# EAGLE board de0 (EAGLE 9.6.2), part 1 of 2
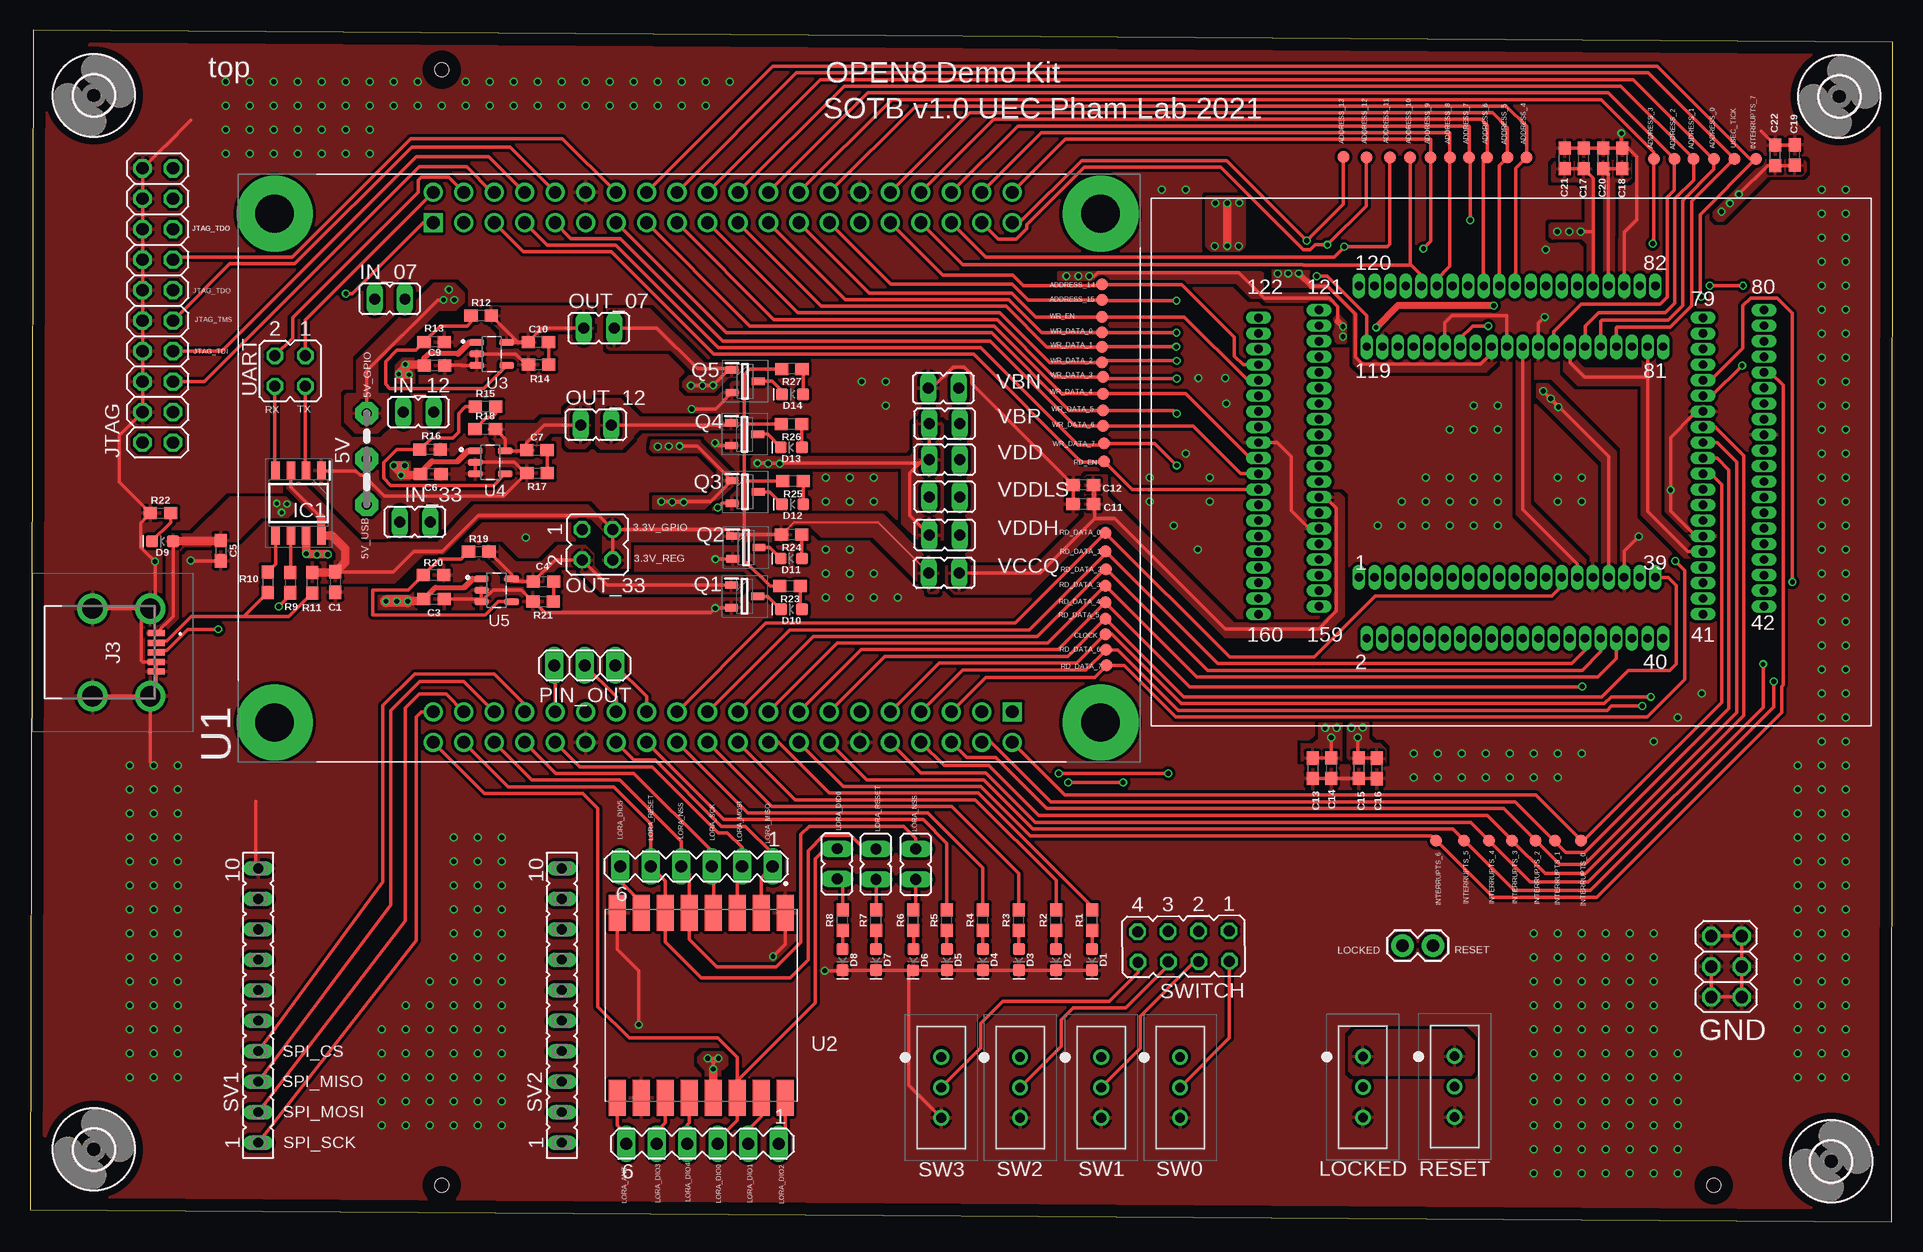
[diagram p2: board, top side]
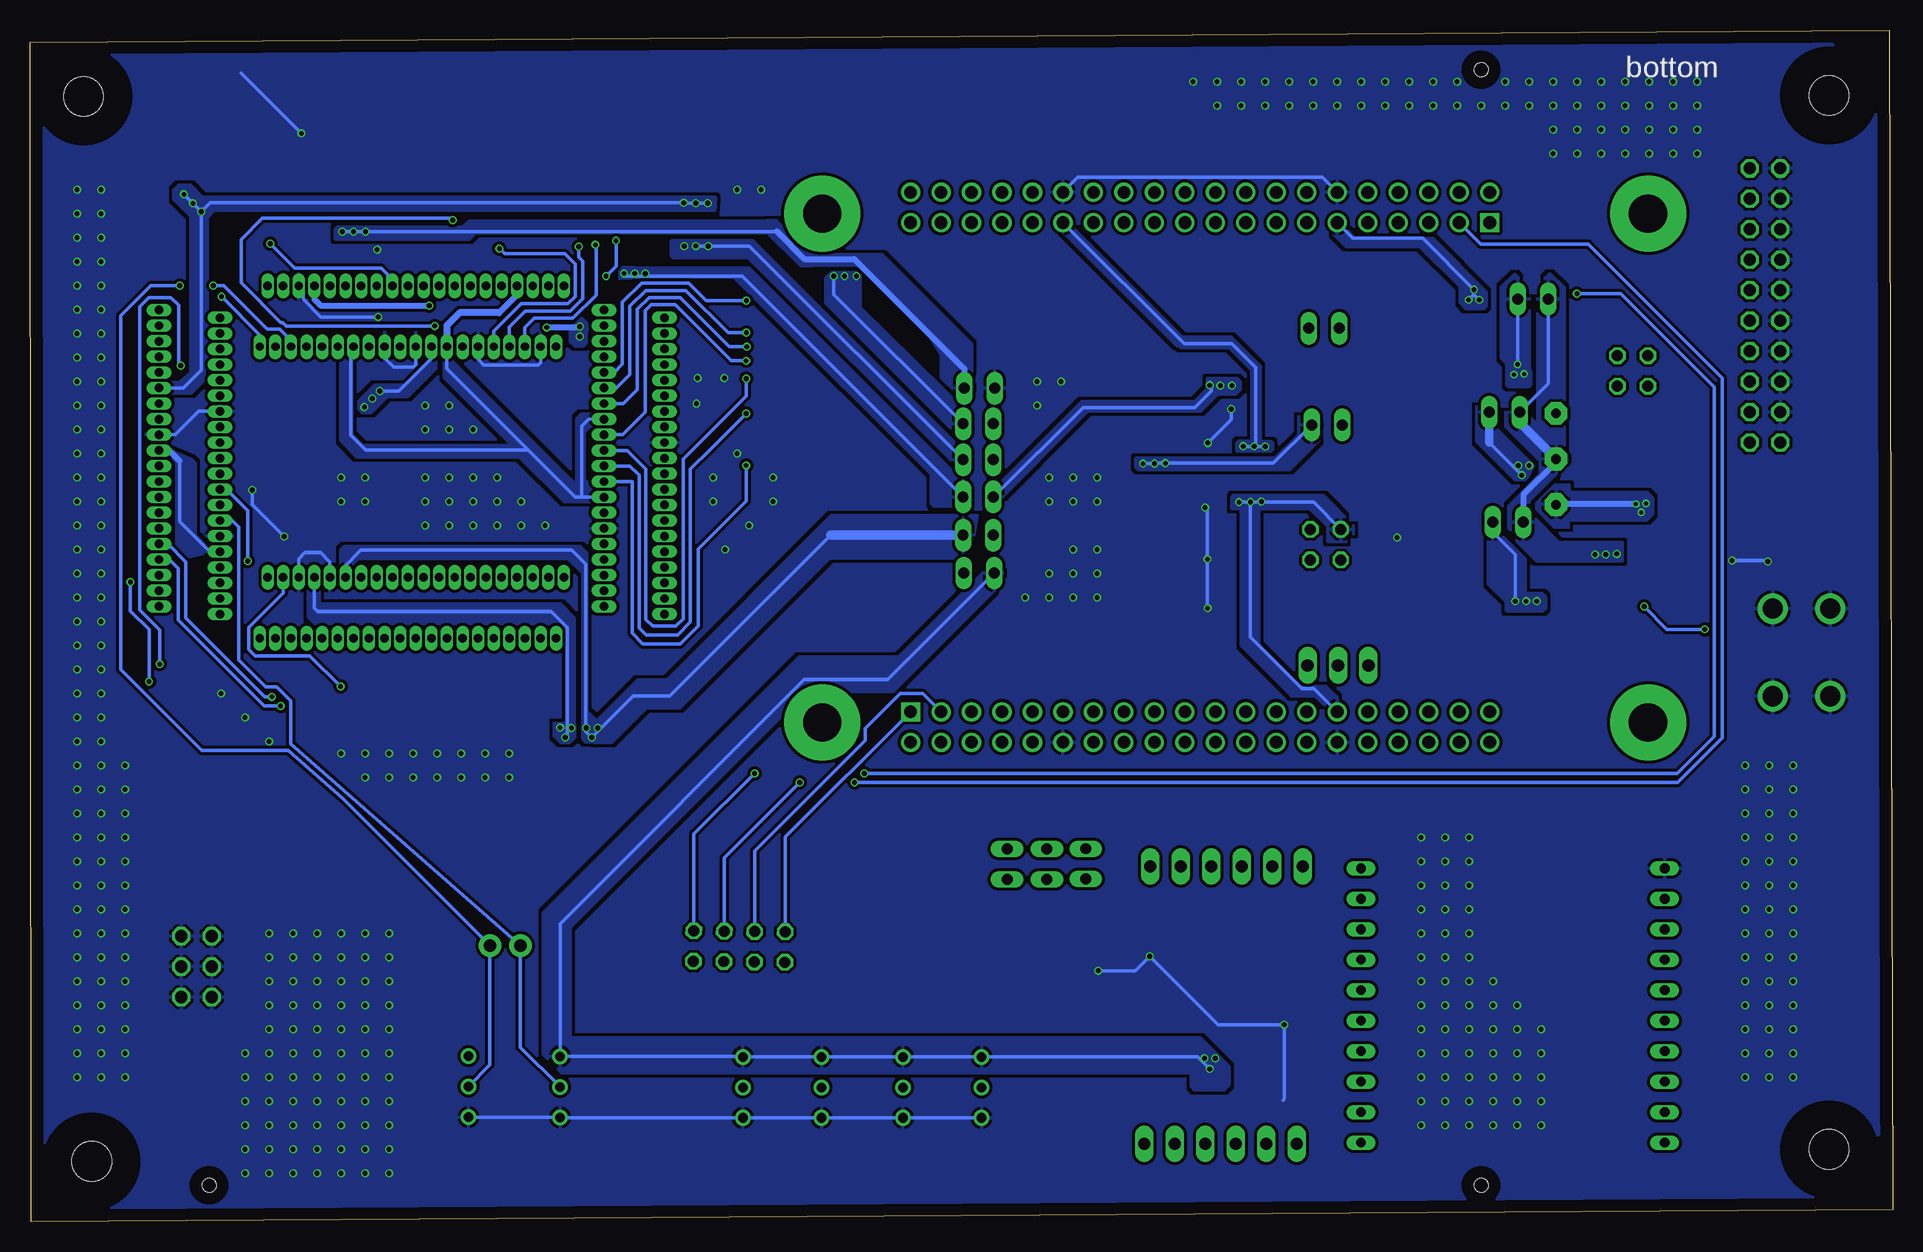
[diagram p3: board, bottom side, seen from below]

Size 155.24 x 99.34 mm. Coordinates in mm from the lower left corner, seen from the top.
Outline: 0,0.97 155.15,0 155.24,98.32 0.29,99.34 0,0.97
Copper layers (1*16): Top 0.035mm / dielectric 1.5mm / Bottom 0.035mm
Design rules "default *": minimum track width 6mil, minimum drill 0.35mm, track to track 10mil, track to pad 10mil, pad to pad 6mil, via to via 10mil, smd to smd 6mil, copper to edge 40mil, drill to drill 6mil, minimum pad ring 0.13mm, minimum via ring 0.13mm, stop-mask expansion 4mil, vias tented up to drill 0mil, thermal gap 10mil
Holes 1.15 mm at 34.32,96.02 140.32,3.02 34.32,3.02

## Footprints (pad centres in the part's own frame; a part is rotated, then mirrored left to right if it is on the bottom)
04C = drill 0.813 pad 1.905 octagon: 1 -1.905,0; 2 1.905,0; 3 5.715,0
POINT = smd 1 x 1: 1 0,0
0603 = smd 1.1 x 1: 1 -0.85,0; 2 0.85,0
LED-0603 = smd 1 x 1: A -0.877,0; C 0.877,0
3,3 = hole 3.3: 0,0
SOIC127P600X170-8N = smd 1.525 x 0.7: 1 -2.712,1.905; 2 -2.712,0.635; 3 -2.712,-0.635; 4 -2.712,-1.905; 5 2.712,-1.905; 6 2.712,-0.635; 7 2.712,0.635; 8 2.712,1.905
JP1 = drill 0.914 long: 1 0,-1.27; 2 0,1.27
1X02 = drill 1.016 pad 1.88: 1 0,0; 2 2.54,0
UMM5DDW1 = smd 0.5 x 1.4: 1 -1.6,3.625; 2 -0.8,3.625; 3 0,3.625; 4 0.8,3.625; 5 1.6,3.625 | drill 1.68 pad 2.5: MH1 -3.65,-1.675; MH2 3.65,-1.675; MH3 3.65,3.125; MH4 -3.65,3.125
2X03 = drill 1.016 octagon: 1 -2.54,-1.27; 2 -2.54,1.27; 3 0,-1.27; 4 0,1.27; 5 2.54,-1.27; 6 2.54,1.27
2X10 = drill 1.016 octagon: 1 -11.43,-1.27; 2 -11.43,1.27; 3 -8.89,-1.27; 4 -8.89,1.27; 5 -6.35,-1.27; 6 -6.35,1.27; 7 -3.81,-1.27; 8 -3.81,1.27; 9 -1.27,-1.27; 10 -1.27,1.27; 11 1.27,-1.27; 12 1.27,1.27; 13 3.81,-1.27; 14 3.81,1.27; 15 6.35,-1.27; 16 6.35,1.27; 17 8.89,-1.27; 18 8.89,1.27; 19 11.43,-1.27; 20 11.43,1.27
SS12SDP2 = drill 0.8 pad 1.3: 1 0,2.54; 2 0,0; 3 0,-2.54
JP2Q = drill 0.914 octagon: 1 -1.27,-1.27; 2 -1.27,1.27; 3 1.27,-1.27; 4 1.27,1.27
1X03 = drill 1.016 long: 1 -2.54,0; 2 0,0; 3 2.54,0
SOT95P230X110-3N = smd 1.05 x 0.6: 1 -1.1,0.95; 2 -1.1,-0.95; 3 1.1,0
FE10 = drill 0.813 long: 1 -11.43,0; 2 -8.89,0; 3 -6.35,0; 4 -3.81,0; 5 -1.27,0; 6 1.27,0; 7 3.81,0; 8 6.35,0; 9 8.89,0; 10 11.43,0
MA06-1 = drill 1.016 long: 1 -6.35,0; 2 -3.81,0; 3 -1.27,0; 4 1.27,0; 5 3.81,0; 6 6.35,0
JP4Q = drill 0.914 octagon: 1 -3.81,-1.27; 2 -3.81,1.27; 3 -1.27,-1.27; 4 -1.27,1.27; 5 1.27,-1.27; 6 1.27,1.27; 7 3.81,-1.27; 8 3.81,1.27
MODULE_P0082_BOTTOMMOUNT = drill 1.06 square: JP1_1 20.45,21.33; JP2_1 -20.32,-26.93 | drill 1.06: JP1_2 22.99,21.33; JP1_3 20.45,18.79; JP1_4 22.99,18.79; JP1_5 20.45,16.25; JP1_6 22.99,16.25; JP1_7 20.45,13.71; JP1_8 22.99,13.71; JP1_9 20.45,11.17; JP1_10 22.99,11.17; JP1_11 20.45,8.63; JP1_12 22.99,8.63; JP1_13 20.45,6.09; JP1_14 22.99,6.09; JP1_15 20.45,3.55; JP1_16 22.99,3.55; JP1_17 20.45,1.01; JP1_18 22.99,1.01; JP1_19 20.45,-1.53; JP1_20 22.99,-1.53; JP1_21 20.45,-4.07; JP1_22 22.99,-4.07; JP1_23 20.45,-6.61; JP1_24 22.99,-6.61; JP1_25 20.45,-9.15; JP1_26 22.99,-9.15; JP1_27 20.45,-11.69; JP1_28 22.99,-11.69; JP1_29 20.45,-14.23; JP1_30 22.99,-14.23; JP1_31 20.45,-16.77; JP1_32 22.99,-16.77; JP1_33 20.45,-19.31; JP1_34 22.99,-19.31; JP1_35 20.45,-21.85; JP1_36 22.99,-21.85; JP1_37 20.45,-24.39; JP1_38 22.99,-24.39; JP1_39 20.45,-26.93; JP1_40 22.99,-26.93; JP2_2 -22.86,-26.93; JP2_3 -20.32,-24.39; JP2_4 -22.86,-24.39; JP2_5 -20.32,-21.85; JP2_6 -22.86,-21.85; JP2_7 -20.32,-19.31; JP2_8 -22.86,-19.31; JP2_9 -20.32,-16.77; JP2_10 -22.86,-16.77; JP2_11 -20.32,-14.23; JP2_12 -22.86,-14.23; JP2_13 -20.32,-11.69; JP2_14 -22.86,-11.69; JP2_15 -20.32,-9.15; JP2_16 -22.86,-9.15; JP2_17 -20.32,-6.61; JP2_18 -22.86,-6.61; JP2_19 -20.32,-4.07; JP2_20 -22.86,-4.07; JP2_21 -20.32,-1.53; JP2_22 -22.86,-1.53; JP2_23 -20.32,1.01; JP2_24 -22.86,1.01; JP2_25 -20.32,3.55; JP2_26 -22.86,3.55; JP2_27 -20.32,6.09; JP2_28 -22.86,6.09; JP2_29 -20.32,8.63; JP2_30 -22.86,8.63; JP2_31 -20.32,11.17; JP2_32 -22.86,11.17; JP2_33 -20.32,13.71; JP2_34 -22.86,13.71; JP2_35 -20.32,16.25; JP2_36 -22.86,16.25; JP2_37 -20.32,18.79; JP2_38 -22.86,18.79; JP2_39 -20.32,21.33; JP2_40 -22.86,21.33 | drill 3.2 pad 6.35: S1 -21.21,34.54; S2 21.21,34.54; S3 -21.21,-34.29; S4 21.21,-34.29
XCVR_RFM95W-915S2 = smd 3 x 1.4: 1 -7.7,7; 2 -7.7,5; 3 -7.7,3; 4 -7.7,1; 5 -7.7,-1; 6 -7.7,-3; 7 -7.7,-5; 8 -7.7,-7; 9 7.7,-7; 10 7.7,-5; 11 7.7,-3; 12 7.7,-1; 13 7.7,1; 14 7.7,3; 15 7.7,5; 16 7.7,7
SOT95P280X145-5N = smd 1.21 x 0.59: 1 -1.255,0.95; 2 -1.255,0; 3 -1.255,-0.95; 4 1.255,-0.95; 5 1.255,0.95
QFP160_SOCKET = drill 0.7 pad 0.7 long: 1 -12.675,-9.62; 2 -12.025,-14.7; 3 -11.375,-9.62; 4 -10.725,-14.7; 5 -10.075,-9.62; 6 -9.425,-14.7; 7 -8.775,-9.62; 8 -8.125,-14.7; 9 -7.475,-9.62; 10 -6.825,-14.7; 11 -6.175,-9.62; 12 -5.525,-14.7; 13 -4.875,-9.62; 14 -4.225,-14.7; 15 -3.575,-9.62; 16 -2.925,-14.7; 17 -2.275,-9.62; 18 -1.625,-14.7; 19 -0.975,-9.62; 20 -0.325,-14.7; 21 0.325,-9.62; 22 0.975,-14.7; 23 1.625,-9.62; 24 2.275,-14.7; 25 2.925,-9.62; 26 3.575,-14.7; 27 4.225,-9.62; 28 4.875,-14.7; 29 5.525,-9.62; 30 6.175,-14.7; 31 6.825,-9.62; 32 7.475,-14.7; 33 8.125,-9.62; 34 8.775,-14.7; 35 9.425,-9.62; 36 10.075,-14.7; 37 10.725,-9.62; 38 11.375,-14.7; 39 12.025,-9.62; 40 12.675,-14.7; 41 16,-12.675; 42 21.08,-12.025; 43 16,-11.375; 44 21.08,-10.725; 45 16,-10.075; 46 21.08,-9.425; 47 16,-8.775; 48 21.08,-8.125; 49 16,-7.475; 50 21.08,-6.825; 51 16,-6.175; 52 21.08,-5.525; 53 16,-4.875; 54 21.08,-4.225; 55 16,-3.575; 56 21.08,-2.925; 57 16,-2.275; 58 21.08,-1.625; 59 16,-0.975; 60 21.08,-0.325; 61 16,0.325; 62 21.08,0.975; 63 16,1.625; 64 21.08,2.275; 65 16,2.925; 66 21.08,3.575; 67 16,4.225; 68 21.08,4.875; 69 16,5.525; 70 21.08,6.175; 71 16,6.825; 72 21.08,7.475; 73 16,8.125; 74 21.08,8.775; 75 16,9.425; 76 21.08,10.075; 77 16,10.725; 78 21.08,11.375; 79 16,12.025; 80 21.08,12.675; 81 12.675,9.62; 82 12.025,14.7; 83 11.375,9.62; 84 10.725,14.7; 85 10.075,9.62; 86 9.425,14.7; 87 8.775,9.62; 88 8.125,14.7; 89 7.475,9.62; 90 6.825,14.7; 91 6.175,9.62; 92 5.525,14.7; 93 4.875,9.62; 94 4.225,14.7; 95 3.575,9.62; 96 2.925,14.7; 97 2.275,9.62; 98 1.625,14.7; 99 0.975,9.62; 100 0.325,14.7; 101 -0.325,9.62; 102 -0.975,14.7; 103 -1.625,9.62; 104 -2.275,14.7; 105 -2.925,9.62; 106 -3.575,14.7; 107 -4.225,9.62; 108 -4.875,14.7; 109 -5.525,9.62; 110 -6.175,14.7; 111 -6.825,9.62; 112 -7.475,14.7; 113 -8.125,9.62; 114 -8.775,14.7; 115 -9.425,9.62; 116 -10.075,14.7; 117 -10.725,9.62; 118 -11.375,14.7; 119 -12.025,9.62; 120 -12.675,14.7; 121 -16,12.675; 122 -21.06,12.025; 123 -16,11.375; 124 -21.06,10.725; 125 -16,10.075; 126 -21.06,9.425; 127 -16,8.775; 128 -21.06,8.125; 129 -16,7.475; 130 -21.06,6.825; 131 -16,6.175; 132 -21.06,5.525; 133 -16,4.875; 134 -21.06,4.225; 135 -16,3.575; 136 -21.06,2.925; 137 -16,2.275; 138 -21.06,1.625; 139 -16,0.975; 140 -21.06,0.325; 141 -16,-0.325; 142 -21.06,-0.975; 143 -16,-1.625; 144 -21.06,-2.275; 145 -16,-2.925; 146 -21.06,-3.575; 147 -16,-4.225; 148 -21.06,-4.875; 149 -16,-5.525; 150 -21.06,-6.175; 151 -16,-6.825; 152 -21.06,-7.475; 153 -16,-8.125; 154 -21.06,-8.775; 155 -16,-9.425; 156 -21.06,-10.075; 157 -16,-10.725; 158 -21.06,-11.375; 159 -16,-12.025; 160 -21.06,-12.675

## Placement (x,y rotation side)
5V  JUMPER_IN_50  [04C]  28.07,61.67 90 top
ADDRESS_0  [POINT]  140.33,88.6 0 top
ADDRESS_1  [POINT]  138.63,88.6 0 top
ADDRESS_2  [POINT]  137.03,88.6 0 top
ADDRESS_3  [POINT]  135.33,88.6 0 top
ADDRESS_4  [POINT]  124.72,88.72 0 top
ADDRESS_5  [POINT]  123.12,88.72 0 top
ADDRESS_6  [POINT]  121.42,88.72 0 top
ADDRESS_7  [POINT]  119.92,88.72 0 top
ADDRESS_8  [POINT]  118.32,88.72 0 top
ADDRESS_9  [POINT]  116.72,88.72 0 top
ADDRESS_10  [POINT]  115.02,88.72 0 top
ADDRESS_11  [POINT]  113.32,88.72 0 top
ADDRESS_12  [POINT]  111.36,88.72 0 top
ADDRESS_13  [POINT]  109.45,88.74 0 top
ADDRESS_14  [POINT]  89.32,78.12 0 top
ADDRESS_15  [POINT]  89.32,76.82 0 top
C1  1.0uF  [0603]  25.44,53.32 270 top
C3  1.0uF  [0603]  33.66,51.89 0 top
C4  4.7uF  [0603]  42.8,53.35 0 top
C5  10uF  [0603]  15.88,55.94 270 top
C6  1.0uF  [0603]  33.4,62.33 0 top
C7  4.7uF  [0603]  42.24,64.32 0 top
C9  1.0uF  [0603]  33.71,71.38 0 top
C10  4.7uF  [0603]  42.36,73.33 0 top
C11  10uF  [0603]  87.77,59.8 180 top
C12  0.1uF  [0603]  87.77,61.4 180 top
C13  10uF  [0603]  106.89,37.79 270 top
C14  0.1uF  [0603]  108.42,37.8 270 top
C15  10uF  [0603]  110.73,37.8 270 top
C16  0.1uF  [0603]  112.21,37.78 270 top
C17  0.1uF  [0603]  129.48,88.64 90 top
C18  0.1uF  [0603]  132.69,88.63 90 top
C19  0.1uF  [0603]  147.07,88.91 90 top
C20  10uF  [0603]  131.1,88.63 90 top
C21  10uF  [0603]  127.89,88.64 90 top
C22  10uF  [0603]  145.44,88.88 90 top
CLOCK  [POINT]  89.62,48.97 0 top
D1  LED0  [LED-0603]  88.51,21.83 270 top
D2  LED1  [LED-0603]  85.51,21.83 270 top
D3  LED2  [LED-0603]  82.41,21.83 270 top
D4  LED3  [LED-0603]  79.41,21.83 270 top
D5  LED4  [LED-0603]  76.41,21.83 270 top
D6  LED5  [LED-0603]  73.61,21.83 268.9 top
D7  LED6  [LED-0603]  70.51,21.83 270 top
D8  LED7  [LED-0603]  67.71,21.83 270 top
D9  POWER LED  [LED-0603]  11.04,56.72 180 top
D10  LED0  [LED-0603]  63.46,51.04 180 top
D11  LED0  [LED-0603]  63.44,55.28 180 top
D12  LED0  [LED-0603]  63.56,59.79 180 top
D13  LED0  [LED-0603]  63.44,64.54 180 top
D14  LED0  [LED-0603]  63.55,68.97 180 top
H1  MOUNT-HOLE3.3  [3,3]  5.32,93.88 0 top
H2  MOUNT-HOLE3.3  [3,3]  5.32,6.02 0 top
H3  MOUNT-HOLE3.3  [3,3]  150.1,5.02 0 top
H4  MOUNT-HOLE3.3  [3,3]  150.78,93.8 0 top
IC1  PL2303SA__LF  [SOIC127P600X170-8N]  22.38,59.9 270 top
IN_07  REG_IN_07  [JP1]  29.98,76.91 270 top
IN_12  REG_IN_12  [JP1]  32.37,67.47 270 top
IN_33  REG_IN_33  [JP1]  32.07,58.32 270 top
INTERRUPTS_6  INTERRUPTS_6  [POINT]  117.17,31.77 0 top
J1  [1X02]  114.37,23.01 0 top
J3  U-M-M5DD-W-1  [UMM5DDW1]  6.89,47.45 270 top
JP12  GND  [2X03]  141.37,21.26 90 top
JTAG  JTAG PIN  [2X10]  10.65,76.38 90 top
LOCKED  SS12SDP2  [SS12SDP2]  111.07,11.23 0 top
LORA_DIO0  [JP1]  67.26,29.82 180 top
LORA_NSS  [JP1]  73.82,29.78 180 top
LORA_RESET  [JP1]  70.5,29.8 180 top
OUT_07  REG_OUT_07  [JP1]  47.4,74.48 270 top
OUT_12  REG_OUT_12  [JP1]  47.15,66.42 270 top
OUT_33  [JP2Q]  47.28,56.43 270 top
PIN_OUT  PIN_OUT  [1X03]  46.24,46.37 180 top
Q1  BSH103,235  [SOT95P230X110-3N]  59.55,52.13 0 top
Q2  BSH103,235  [SOT95P230X110-3N]  59.66,56.2 0 top
Q3  BSH103,235  [SOT95P230X110-3N]  59.59,60.84 0 top
Q4  BSH103,235  [SOT95P230X110-3N]  59.55,65.64 0 top
Q5  BSH103,235  [SOT95P230X110-3N]  59.59,70.05 0 top
R1  330  [0603]  88.51,25.13 90 top
R2  330  [0603]  85.51,25.13 90 top
R3  330  [0603]  82.41,25.13 90 top
R4  330  [0603]  79.41,25.13 90 top
R5  330  [0603]  76.41,25.13 90 top
R6  330  [0603]  73.61,25.13 90 top
R7  330  [0603]  70.51,25.13 90 top
R8  330  [0603]  67.71,25.13 90 top
R9  27  [0603]  21.69,53.27 270 top
R10  27  [0603]  19.81,53.3 270 top
R11  1.5k  [0603]  23.54,53.25 90 top
R12  3.3k  [0603]  37.6,75.54 0 top
R13  62KOHM-0603-1/10W-5%  [0603]  33.68,73.33 180 top
R14  1  [0603]  42.39,71.44 0 top
R15  43k  [0603]  37.96,67.95 0 top
R16  62KOHM-0603-1/10W-5%  [0603]  33.34,64.37 180 top
R17  1  [0603]  42.26,62.4 0 top
R18  10k  [0603]  37.94,66.08 0 top
R19  240  [0603]  37.4,55.85 0 top
R20  62KOHM-0603-1/10W-5%  [0603]  33.62,53.89 180 top
R21  1  [0603]  42.76,51.68 0 top
R22  330  [0603]  10.88,59.06 0 top
R23  330  [0603]  63.34,52.97 180 top
R24  330  [0603]  63.47,57.26 180 top
R25  330  [0603]  63.59,61.72 180 top
R26  330  [0603]  63.46,66.48 180 top
R27  330  [0603]  63.49,71.09 180 top
RD_DATA_0  [POINT]  89.62,57.42 0 top
RD_DATA_2  [POINT]  89.67,54.37 0 top
RD_DATA_3  [POINT]  89.62,53.02 0 top
RD_DATA_4  [POINT]  89.62,51.62 0 top
RD_DATA_5  [POINT]  89.62,50.27 0 top
RD_DATA_6  [POINT]  89.67,47.67 0 top
RD_DATA_7  [POINT]  89.72,46.37 0 top
RD_EN  [POINT]  89.52,63.37 0 top
RESET  SS12SDP2  [SS12SDP2]  118.71,11.25 0 top
SV1  SPI0  [FE10]  19.02,18.02 90 top
SV2  SPI1  [FE10]  44.32,18.02 90 top
SV3  [MA06-1]  55.53,29.61 180 top
SV4  [MA06-1]  56.04,6.49 180 top
SW0  SS12SDP2  [SS12SDP2]  95.84,11.19 0 top
SW1  SS12SDP2  [SS12SDP2]  89.27,11.19 0 top
SW2  SS12SDP2  [SS12SDP2]  82.5,11.19 0 top
SW3  SS12SDP2  [SS12SDP2]  75.94,11.19 0 top
SWITCH  SWITCH  [JP4Q]  96.13,22.93 180.6 top
U1  P0082  [MODULE_P0082_BOTTOMMOUNT]  54.93,62.82 90 top
U2  RFM95W-915S2  [XCVR_RFM95W-915S2]  55.93,18.03 270 top
U3  TPS76201DBVR  [SOT95P280X145-5N]  38.49,72.33 0 top
U4  TPS76201DBVR  [SOT95P280X145-5N]  38.36,63.3 0 top
U5  TPS76201DBVR  [SOT95P280X145-5N]  38.88,52.64 0 top
U$1  SOCKET  [QFP160_SOCKET]  123.42,63.32 0 top
U$4  [POINT]  89.62,55.87 0 top
U$10  INTERRUPTS_0  [POINT]  129.27,31.77 0 top
U$11  INTERRUPTS_1  [POINT]  127.07,31.77 0 top
U$12  INTERRUPTS_2  [POINT]  125.47,31.77 0 top
U$13  INTERRUPTS_3  [POINT]  123.52,31.77 0 top
U$14  INTERRUPTS_5  [POINT]  121.57,31.77 0 top
U$15  INTERRUPTS_5  [POINT]  119.52,31.77 0 top
U$17  INTERRUPTS_7  [POINT]  143.83,88.6 0 top
U$40  [POINT]  89.42,66.32 0 top
UART  UART  [JP2Q]  21.68,70.92 180 top
USEC_TICK  [POINT]  142.03,88.6 0 top
VBN  VBN  [JP1]  76.12,69.47 270 top
VBP  VBP  [JP1]  76.22,66.52 270 top
VCCQ  VCCQ  [JP1]  76.17,54.07 270 top
VDD  VDD  [JP1]  76.22,63.52 270 top
VDDH  VDDH  [JP1]  76.22,57.22 270 top
VDDLS  VDDLS  [JP1]  76.22,60.42 270 top
WR_DATA_0  [POINT]  89.32,74.12 0 top
WR_DATA_1  [POINT]  89.32,72.92 0 top
WR_DATA_2  [POINT]  89.32,71.62 0 top
WR_DATA_3  [POINT]  89.42,70.42 0 top
WR_DATA_4  [POINT]  89.42,69.02 0 top
WR_DATA_5  [POINT]  89.42,67.62 0 top
WR_DATA_7  [POINT]  89.52,64.87 0 top
WR_EN  [POINT]  89.32,75.42 0 top